# EAGLE design 128x32 (EAGLE 7.4.0)
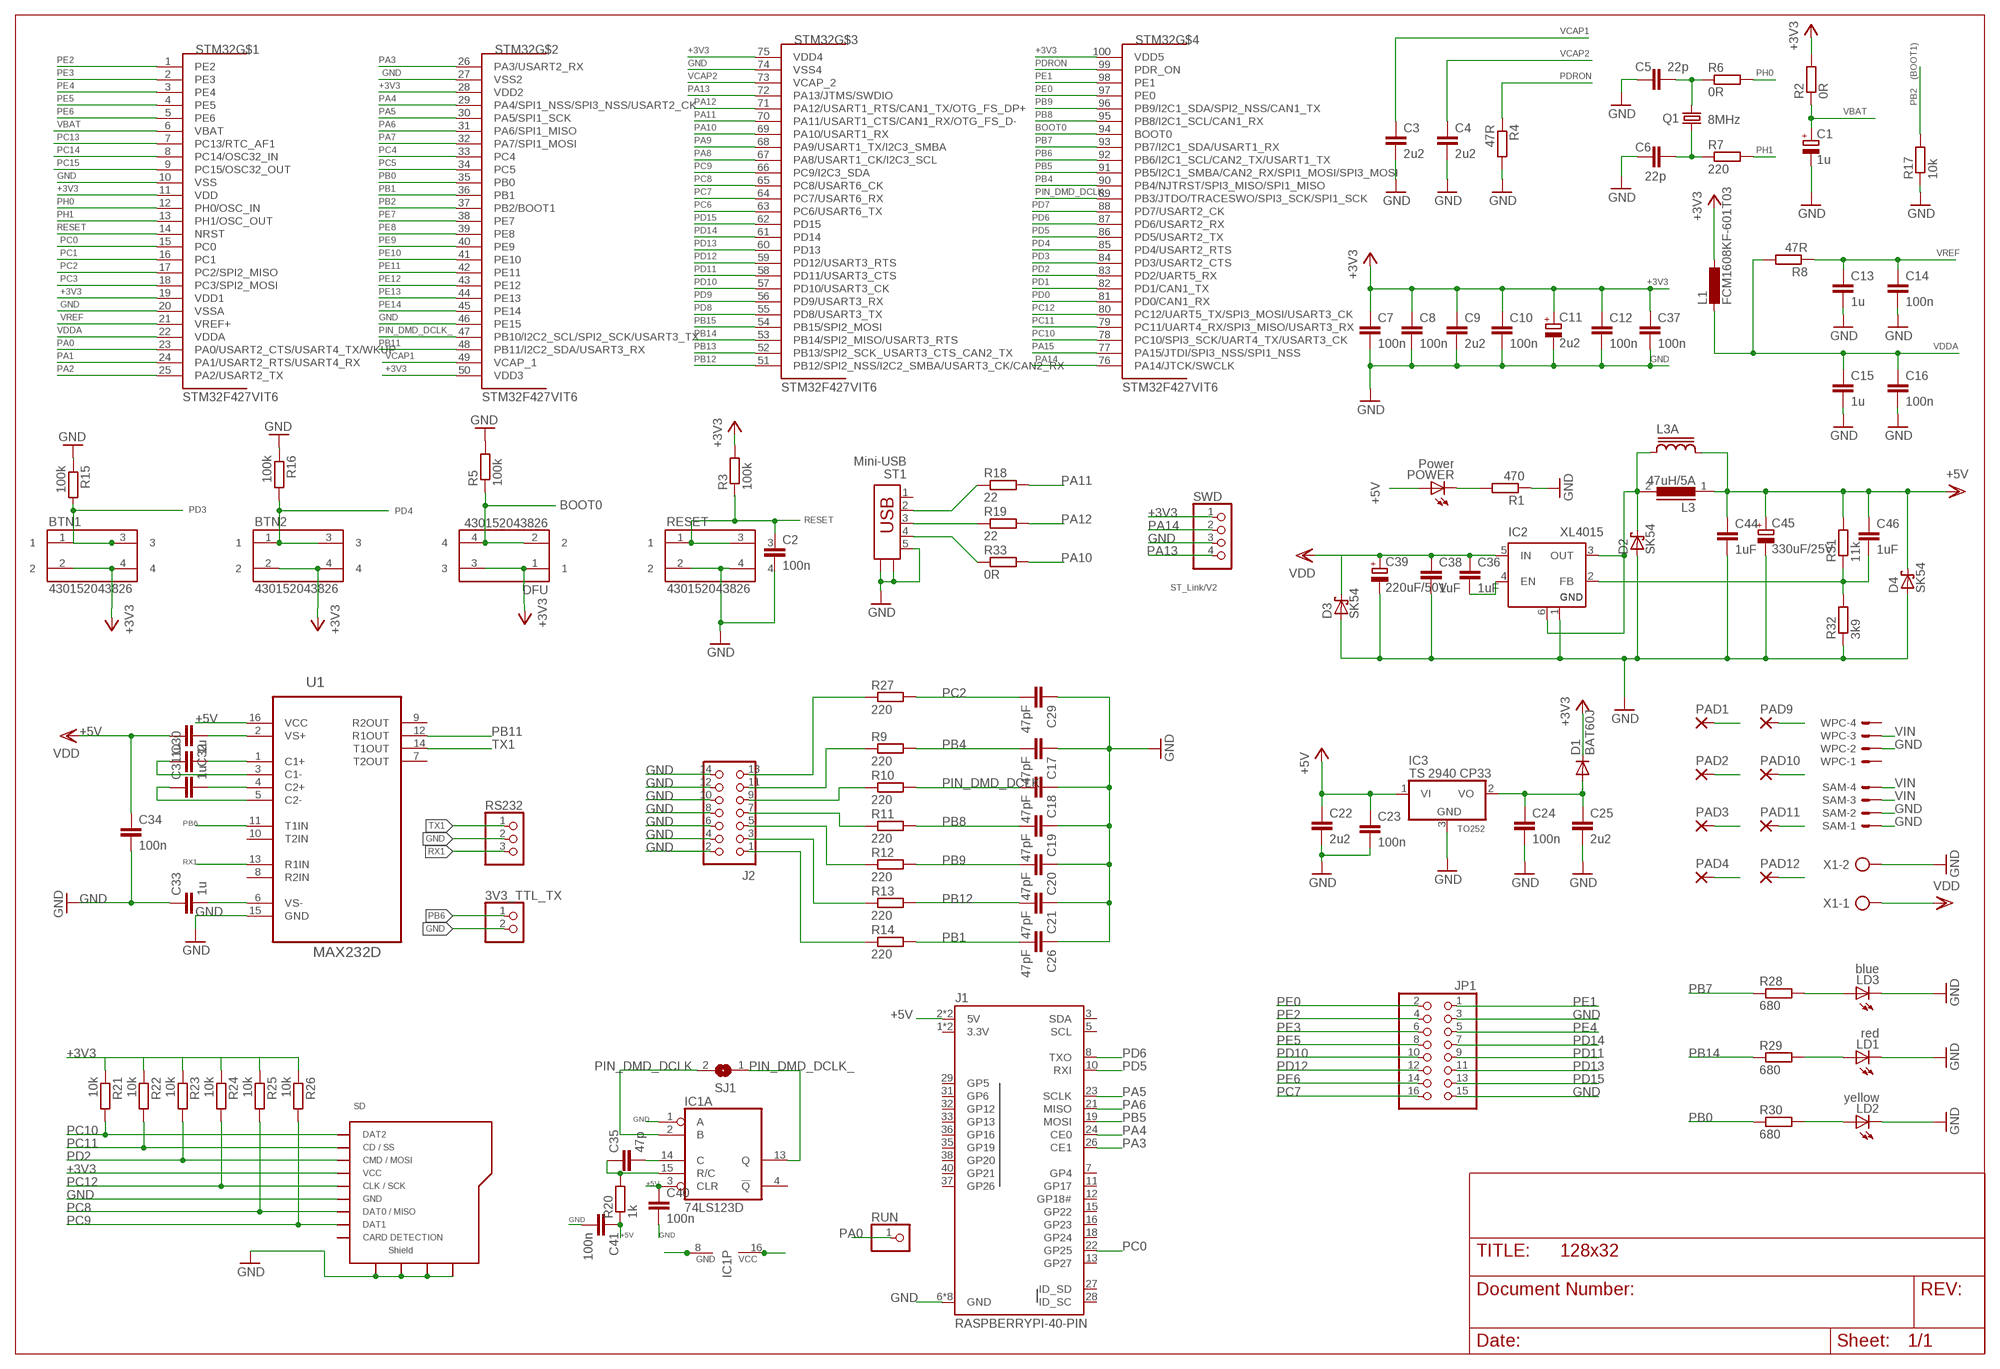
[diagram p0: schematic, sheet 1]

## Parts
3V3_TTL_TX  PINHD-1X2  [1X02]
BTN1  430152043826  [430152043826]
BTN2  430152043826  [430152043826]
C1  1u  CPOL-EUCT3528  [CT3528]
C2  100n  C-EUC0805  [C0805]
C3  2u2  C-EUC0805  [C0805]
C4  2u2  C-EUC0805  [C0805]
C5  22p  C-EUC0805  [C0805]
C6  22p  C-EUC0805  [C0805]
C7  100n  C-EUC0805  [C0805]
C8  100n  C-EUC0805  [C0805]
C9  2u2  C-EUC1206  [C1206]
C10  100n  C-EUC0805  [C0805]
C11  2u2  CPOL-EUCT3528  [CT3528]
C12  100n  C-EUC0805  [C0805]
C13  1u  C-EUC1206  [C1206]
C14  100n  C-EUC0805  [C0805]
C15  1u  C-EUC1206  [C1206]
C16  100n  C-EUC0805  [C0805]
C17  47pF  C-EUC0805  [C0805]
C18  47pF  C-EUC0805  [C0805]
C19  47pF  C-EUC0805  [C0805]
C20  47pF  C-EUC0805  [C0805]
C21  47pF  C-EUC0805  [C0805]
C22  2u2  C-EUC1206  [C1206]
C23  100n  C-EUC0805  [C0805]
C24  100n  C-EUC0805  [C0805]
C25  2u2  C-EUC1206  [C1206]
C26  47pF  C-EUC0805  [C0805]
C29  47pF  C-EUC0805  [C0805]
C30  1u  C-EUC0805  [C0805]
C31  1u  C-EUC0805  [C0805]
C32  1u  C-EUC0805  [C0805]
C33  1u  C-EUC0805  [C0805]
C34  100n  C-EUC0805  [C0805]
C35  47p  C-EUC0805  [C0805]
C36  1uF  C-EUC1206  [C1206]
C37  100n  C-EUC0805  [C0805]
C38  1uF  C-EUC1206  [C1206]
C39  220uF/50V  CPOL-EUG  [PANASONIC_G]
C40  100n  C-EUC0805  [C0805]
C41  100n  C-EUC0805  [C0805]
C44  1uF  C-EUC1206  [C1206]
C45  330uF/25V  CPOL-EUG  [PANASONIC_G]
C46  1uF  C-EUC1206  [C1206]
D1  BAT60J  DIODE-SOD323-W  [SOD323-W]
D2  SK54  SCHOTTKY-DIODESMD  [SMB]
D3  SK54  SCHOTTKY-DIODESMD  [SMB]
D4  SK54  SCHOTTKY-DIODESMD  [SMB]
DFU  430152043826  [430152043826]
IC1  74LS123D  [SO16]
IC2  XL4015  [TO263-5]
IC3  TS 2940 CP33  7808DT  [TO252]
J1  RASPBERRYPI-40-PIN  RASPBERRYPI-40-PIN-GPIO_PTH_NO_SHROUD  [2X20]
J2  CON_HEADER_2X07-PTH-SHROUDED  [PINSHRD_PTH_2X07]
JP1  PINHD-2X8  [2X08]
L1  FCM1608KF-601T03  L-EUL2012C  [L2012C]
L3  47uH/5A  ED16  [ED16]
L3A  SRR1206  [SRR1206]
LD1  red  LEDCHIP-LED0805  [CHIP-LED0805]
LD2  yellow  LEDCHIP-LED0805  [CHIP-LED0805]
LD3  blue  LEDCHIP-LED0805  [CHIP-LED0805]
PAD1  SMD5  [SMD2,54-5,08]
PAD2  SMD5  [SMD2,54-5,08]
PAD3  SMD5  [SMD2,54-5,08]
PAD4  SMD5  [SMD2,54-5,08]
PAD9  SMD5  [SMD2,54-5,08]
PAD10  SMD5  [SMD2,54-5,08]
PAD11  SMD5  [SMD2,54-5,08]
PAD12  SMD5  [SMD2,54-5,08]
POWER  Power  LEDCHIPLED_0805  [CHIPLED_0805]
Q1  8MHz  CRYSTALHC49UP  [HC49UP]
R1  470  R-EU_R0805  [R0805]
R2  0R  R-EU_R0805  [R0805]
R3  100k  R-EU_R0805  [R0805]
R4  47R  R-EU_R0805  [R0805]
R5  100k  R-EU_R0805  [R0805]
R6  0R  R-EU_R0805  [R0805]
R7  220  R-EU_R0805  [R0805]
R8  47R  R-EU_R0805  [R0805]
R9  220  R-EU_R0805  [R0805]
R10  220  R-EU_R0805  [R0805]
R11  220  R-EU_R0805  [R0805]
R12  220  R-EU_R0805  [R0805]
R13  220  R-EU_R0805  [R0805]
R14  220  R-EU_R0805  [R0805]
R15  100k  R-EU_R0805  [R0805]
R16  100k  R-EU_R0805  [R0805]
R17  10k  R-EU_R0805  [R0805]
R18  22  R-EU_R0805  [R0805]
R19  22  R-EU_R0805  [R0805]
R20  1k  R-EU_R0805  [R0805]
R21  10k  R-EU_R0805  [R0805]
R22  10k  R-EU_R0805  [R0805]
R23  10k  R-EU_R0805  [R0805]
R24  10k  R-EU_R0805  [R0805]
R25  10k  R-EU_R0805  [R0805]
R26  10k  R-EU_R0805  [R0805]
R27  220  R-EU_R0805  [R0805]
R28  680  R-EU_R0805  [R0805]
R29  680  R-EU_R0805  [R0805]
R30  680  R-EU_R0805  [R0805]
R31  11k  R-EU_R1206  [R1206]
R32  3k9  R-EU_R1206  [R1206]
R33  0R  R-EU_R0805  [R0805]
RESET  430152043826  [430152043826]
RS232  PINHD-1X3  [1X03]
RUN  PINHD-1X1  [1X01]
SAM  KK-156-4  [KK-156-4]
SD  MICROSD_CARD_POLLIN  [MR**-AP*03**]
SJ1  SJ  [SJ]
ST1  Mini-USB  UBS-MINI  [USBMINI]
STM32  STM32F427VIT6  STM32F407VX  [LQFP100]
SWD  PINHD-1X4  [1X04]
U1  MAX232D  [SOIC127P600X175-16N]
WPC  KK-156-4  [KK-156-4]
X1  AK500/2-H  [AK500/2-H]

## Nets
+3V3: BTN1.2 BTN1.4 BTN2.2 BTN2.4 C7.1 C8.1 C9.1 C10.1 C11.+ C12.1 C37.1 D1.C DFU.1 DFU.3 L1.1 R2.2 R3.2 R21.1 R22.1 R23.1 R24.1 R25.1 R26.1 SD.VCC STM32.11(VDD) STM32.19(VDD1) STM32.28(VDD2) STM32.50(VDD3) STM32.75(VDD4) STM32.100(VDD5) SWD.1
+5V: C22.1 C23.1 C32.2 C34.1 C40.1 C41.1 C44.1 C45.+ C46.1 D4.C IC1.3(A:CLR) IC1.16(P:VCC) IC3.1(VI) J1.2(5V) J1.4(5V) L3.1 L3A.2 PAD1.1(P) PAD2.1(P) PAD9.1(P) PAD10.1(P) POWER.A R20.1 R31.2 U1.16(VCC) ; supply symbol labelled VDD
BOOT0: DFU.2 DFU.4 R5.1 STM32.94(BOOT0)
GND: 3V3_TTL_TX.2 C1.- C2.2 C3.2 C4.2 C5.2 C6.2 C7.2 C8.2 C9.2 C10.2 C11.- C12.2 C13.2 C14.2 C15.2 C16.2 C17.1 C18.1 C19.1 C20.1 C21.1 C22.2 C23.2 C24.2 C25.2 C26.1 C29.1 C33.1 C34.2 C37.2 C38.2 C39.- C40.2 C41.2 C44.2 C45.- D2.A D3.A D4.A IC1.1(A:A) IC1.8(P:GND) IC2.1(GND) IC3.3(GND) J1.6(GND) J1.9(GND) J1.14(GND) J1.20(GND) J1.25(GND) J1.30(GND) J1.34(GND) J1.39(GND) J2.2 J2.4 J2.6 J2.8 J2.10 J2.12 J2.14 JP1.3 JP1.15 LD1.C LD2.C LD3.C PAD3.1(P) PAD4.1(P) PAD11.1(P) PAD12.1(P) R1.1 R4.2 R5.2 R15.1 R16.1 R17.1 R32.1 RESET.2 RESET.4 RS232.2 SAM.1 SAM.2 SD.GND SD.SHD_1(SHD1) SD.SHD_2(SHD2) SD.SHD_3(SHD3) SD.SHD_4(SHD4) ST1.5 ST1.N1 ST1.N2 STM32.10(VSS) STM32.20(VSSA) STM32.27(VSS2) STM32.46(PE15) STM32.74(VSS4) SWD.3 U1.15(GND) WPC.2 X1.2
N$1: C5.1 Q1.2 R6.1
N$2: C6.1 Q1.1 R7.1
N$3: POWER.C R1.2
N$4: J2.13 R27.1
N$5: J2.11 R9.1
N$6: J2.9 R10.1
N$7: J2.7 R11.1
N$8: J2.5 R12.1
N$9: J2.3 R13.1
N$10: C35.1 IC1.15(A:R/C) R20.2
N$11: J2.1 R14.1
N$12: C24.1 C25.1 D1.A IC3.2(VO)
N$13: C30.2 U1.1(C1+)
N$14: C30.1 U1.3(C1-)
N$15: C31.2 U1.4(C2+)
N$16: C31.1 U1.5(C2-)
N$17: C33.2 U1.6(VS-)
N$18: C32.1 U1.2(VS+)
N$19: LD1.A R29.2
N$20: D2.C IC2.3(OUT) IC2.6(TAB) L3.2 L3A.1
N$21: C46.2 IC2.2(FB) R31.1 R32.2
N$22: C35.2 IC1.14(A:C)
N$23: LD3.A R28.2
N$24: C36.2 IC2.4(EN)
N$25: R33.1 ST1.4
N$26: LD2.A R30.2
N$39: R19.1 ST1.3
N$40: R18.1 ST1.2
PA0: RUN.1 STM32.23(PA0/USART2_CTS/USART4_TX/WKUP)
PA1: STM32.24(PA1/USART2_RTS/USART4_RX)
PA2: STM32.25(PA2/USART2_TX)
PA3: J1.26(CE1) STM32.26(PA3/USART2_RX)
PA4: J1.24(CE0) STM32.29(PA4/SPI1_NSS/SPI3_NSS/USART2_CK)
PA5: J1.23(SCLK) STM32.30(PA5/SPI1_SCK)
PA6: J1.21(MISO) STM32.31(PA6/SPI1_MISO)
PA7: STM32.32(PA7/SPI1_MOSI)
PA8: STM32.67(PA8/USART1_CK/I2C3_SCL)
PA9: STM32.68(PA9/USART1_TX/I2C3_SMBA)
PA10: R33.2 STM32.69(PA10/USART1_RX)
PA11: R18.2 STM32.70(PA11/USART1_CTS/CAN1_RX/OTG_FS_D-)
PA12: R19.2 STM32.71(PA12/USART1_RTS/CAN1_TX/OTG_FS_DP+)
PA13: STM32.72(PA13/JTMS/SWDIO) SWD.4
PA14: STM32.76(PA14/JTCK/SWCLK) SWD.2
PA15: STM32.77(PA15/JTDI/SPI3_NSS/SPI1_NSS)
PB0: R30.1 STM32.35(PB0)
PB1: C26.2 R14.2 STM32.36(PB1)
PB2: R17.2 STM32.37(PB2/BOOT1)
PB4: C17.2 R9.2 STM32.90(PB4/NJTRST/SPI3_MISO/SPI1_MISO)
PB5: J1.19(MOSI) STM32.91(PB5/I2C1_SMBA/CAN2_RX/SPI1_MOSI/SPI3_MOSI)
PB6: 3V3_TTL_TX.1 STM32.92(PB6/I2C1_SCL/CAN2_TX/USART1_TX) U1.11(T1IN)
PB7: R28.1 STM32.93(PB7/I2C1_SDA/USART1_RX)
PB8: C19.2 R11.2 STM32.95(PB8/I2C1_SCL/CAN1_RX)
PB9: C20.2 R12.2 STM32.96(PB9/I2C1_SDA/SPI2_NSS/CAN1_TX)
PB11: STM32.48(PB11/I2C2_SDA/USART3_RX) U1.12(R1OUT)
PB12: C21.2 R13.2 STM32.51(PB12/SPI2_NSS/I2C2_SMBA/USART3_CK/CAN2_RX)
PB13: STM32.52(PB13/SPI2_SCK_USART3_CTS_CAN2_TX)
PB14: R29.1 STM32.53(PB14/SPI2_MISO/USART3_RTS)
PB15: STM32.54(PB15/SPI2_MOSI)
PC0: J1.22(GP25) STM32.15(PC0)
PC1: STM32.16(PC1)
PC2: C29.2 R27.2 STM32.17(PC2/SPI2_MISO)
PC3: STM32.18(PC3/SPI2_MOSI)
PC4: STM32.33(PC4)
PC5: STM32.34(PC5)
PC6: STM32.63(PC6/USART6_TX)
PC7: JP1.16 STM32.64(PC7/USART6_RX)
PC8: R25.2 SD.DAT0(DAT0/MISO) STM32.65(PC8/USART6_CK)
PC9: R26.2 SD.DAT1 STM32.66(PC9/I2C3_SDA)
PC10: R21.2 SD.DAT2 STM32.78(PC10/SPI3_SCK/UART4_TX/USART3_CK)
PC11: R22.2 SD.DAT3/CS(CD/SS) STM32.79(PC11/UART4_RX/SPI3_MISO/USART3_RX)
PC12: R24.2 SD.CLK(CLK/SCK) STM32.80(PC12/UART5_TX/SPI3_MOSI/USART3_CK)
PC13: STM32.7(PC13/RTC_AF1)
PC14: STM32.8(PC14/OSC32_IN)
PC15: STM32.9(PC15/OSC32_OUT)
PD0: STM32.81(PD0/CAN1_RX)
PD1: STM32.82(PD1/CAN1_TX)
PD2: R23.2 SD.CMD(CMD/MOSI) STM32.83(PD2/UART5_RX)
PD3: BTN1.1 BTN1.3 R15.2 STM32.84(PD3/USART2_CTS)
PD4: BTN2.1 BTN2.3 R16.2 STM32.85(PD4/USART2_RTS)
PD5: J1.10(RXI) STM32.86(PD5/USART2_TX)
PD6: J1.8(TXO) STM32.87(PD6/USART2_RX)
PD7: STM32.88(PD7/USART2_CK)
PD8: STM32.55(PD8/USART3_TX)
PD9: STM32.56(PD9/USART3_RX)
PD10: JP1.10 STM32.57(PD10/USART3_CK)
PD11: JP1.9 STM32.58(PD11/USART3_CTS)
PD12: JP1.12 STM32.59(PD12/USART3_RTS)
PD13: JP1.11 STM32.60(PD13)
PD14: JP1.7 STM32.61(PD14)
PD15: JP1.13 STM32.62(PD15)
PDRON: R4.1 STM32.99(PDR_ON)
PE0: JP1.2 STM32.97(PE0)
PE1: JP1.1 STM32.98(PE1)
PE2: JP1.4 STM32.1(PE2)
PE3: JP1.6 STM32.2(PE3)
PE4: JP1.5 STM32.3(PE4)
PE5: JP1.8 STM32.4(PE5)
PE6: JP1.14 STM32.5(PE6)
PE7: STM32.38(PE7)
PE8: STM32.39(PE8)
PE9: STM32.40(PE9)
PE10: STM32.41(PE10)
PE11: STM32.42(PE11)
PE12: STM32.43(PE12)
PE13: STM32.44(PE13)
PE14: STM32.45(PE14)
PH0: R6.2 STM32.12(PH0/OSC_IN)
PH1: R7.2 STM32.13(PH1/OSC_OUT)
PIN_DMD_DCLK: C18.2 IC1.2(A:B) R10.2 SJ1.2
PIN_DMD_DCLK_: IC1.13(A:Q) SJ1.1 STM32.47(PB10/I2C2_SCL/SPI2_SCK/USART3_TX) STM32.89(PB3/JTDO/TRACESWO/SPI3_SCK/SPI1_SCK)
RESET: C2.1 R3.1 RESET.1 RESET.3 STM32.14(NRST)
RX1: RS232.3 U1.13(R1IN)
TX1: RS232.1 U1.14(T1OUT)
VBAT: C1.+ R2.1 STM32.6(VBAT)
VCAP1: C3.1 STM32.49(VCAP_1)
VCAP2: C4.1 STM32.73(VCAP_2)
VDDA: C15.1 C16.1 L1.2 R8.2 STM32.22(VDDA)
VIN: C36.1 C38.1 C39.+ D3.C IC2.5(IN) SAM.3 SAM.4 WPC.3 X1.1 ; supply symbol labelled VDD
VREF: C13.1 C14.1 R8.1 STM32.21(VREF+)
Unconnected: IC1.4(A:!Q) IC1.5(B:Q) IC1.6(B:C) IC1.7(B:R/C) IC1.9(B:A) IC1.10(B:B) IC1.11(B:CLR) IC1.12(B:!Q) J1.3(SDA) J1.5(SCL) J1.7(GP4) J1.11(GP17) J1.12(GP18#) J1.13(GP27) J1.15(GP22) J1.16(GP23) J1.18(GP24) J1.27(ID_SD) J1.28(ID_SC) J1.29(GP5) J1.31(GP6) J1.32(GP12) J1.33(GP13) J1.35(GP19) J1.36(GP16) J1.37(GP26) J1.38(GP20) J1.40(GP21) SD.CARD_DETECTION(CARD_D) ST1.1 U1.7(T2OUT) U1.8(R2IN) U1.9(R2OUT) U1.10(T2IN) WPC.1 WPC.4

## Notes on the sheet
- (BOOT1)
- ST_Link/V2
- TO252

## Power pins joined to a net without a drawn wire
3.3V: J1.1(3.3V) J1.17(3.3V)

## Library data of the parts
3V3_TTL_TX = pinhead:PINHD-1X2: PIN HEADER
BTN1 BTN2 DFU RESET = Switches_rev16a:430152043826: WS-TSS-6x6 mm SMD Tact Switch,4 pins
C1 C11 = rcl:CPOL-EU: POLARIZED CAPACITOR, European symbol
C2 C5-C8 C10 C12 C16 C23 C24 C37 = rcl:C-EU: CAPACITOR, European symbol
C3 C4 C9 C13-C15 C17-C22 C25 C26 C29-C36 C38 C40 C41 C44 C46 = resistor:C-EU: CAPACITOR, European symbol
C39 C45 = resistor:CPOL-EU: POLARIZED CAPACITOR, European symbol
D1 = diode:DIODE-: DIODE
D2-D4 = diode:SCHOTTKY-DIODE: Schottky Diode
IC1 = 74xx-eu:74*123: Retriggerable monostable MULTIVIBRATOR
IC2 = linear4:XL4015
IC3 = linear:78*: Positive VOLTAGE REGULATOR Source: http://cache.national.com/ds/LM/LM78L05.pdf http://www.fairchildsemi.com/ds/LM/LM7805.pdf
J1 = SparkFun-Connectors:RASPBERRYPI-40-PIN-GPIO: Raspberry Pi GPIO Header 2x20 pin connector, as found on B, B+, A+ models. Both shrouded PTH and SMT versions available. SparkFun Products: GPIO Shrouded Header <https://www.sparkfun.com/products/13054>- PTH SparkFun Pi Wedge (Preassembled) <https://www.sparkfun.com/products/13717>
J2 = dp_devices.v6:CON_HEADER_2X07: 2x07 pin header
JP1 = pinhead:PINHD-2X8: PIN HEADER
L1 = rcl:L-EU: INDUCTOR, European symbol
L3 = inductors:ED16: INDUCTOR
L3A = inductor-bourns:SRR1206: POWER INDUCTOR
LD1-LD3 = adafruit:LED: LED
PAD1-PAD4 PAD9-PAD12 = wirepad:SMD5: SMD PAD
POWER = led:LED: LED
Q1 = crystal:CRYSTAL: CRYSTAL; OC_FARNELL: unknown; OC_NEWARK: unknown
R1 R2 R4 R6-R8 R17 R20 = rcl:R-EU_: RESISTOR, European symbol
R3 R5 R9-R16 R18 R19 R21-R33 = resistor:R-EU_: RESISTOR, European symbol
RS232 = pinhead:PINHD-1X3: PIN HEADER
RUN = pinhead:PINHD-1X1: PIN HEADER
SAM WPC = con-molex:KK-156-4: KK 156 HEADER Source: http://www.molex.com/pdm_docs/sd/026604100_sd.pdf; OC_FARNELL: unknown; OC_NEWARK: unknown
SD = 000_eigene_Bauteile:MICROSD_CARD_POLLIN
SJ1 = jumper:SJ: SMD solder JUMPER
ST1 = con-amp:UBS-MINI
STM32 = STM32F407Vx_LQFP100:STM32F407VX: STmicroelectronics Cortex M4 Series Typ: STM32F407Vx LQFP100 Copyright 2012 by Ersan Günes, Quantitec, info@quantitec.de
SWD = pinhead:PINHD-1X4: PIN HEADER
U1 = MAX232D:MAX232D: DUAL EIA-232 DRIVERS/RECEIVERS
X1 = con-ptr500:AK500/2-H: CONNECTOR Aug. 2004 / PTR Meßtechnik: Die Bezeichnung der Serie AK505 wurde geändert. Es handelt sich hierbei um AK500 in horizontaler Ausführung.; OC_FARNELL: unknown; OC_NEWARK: unknown

## Board
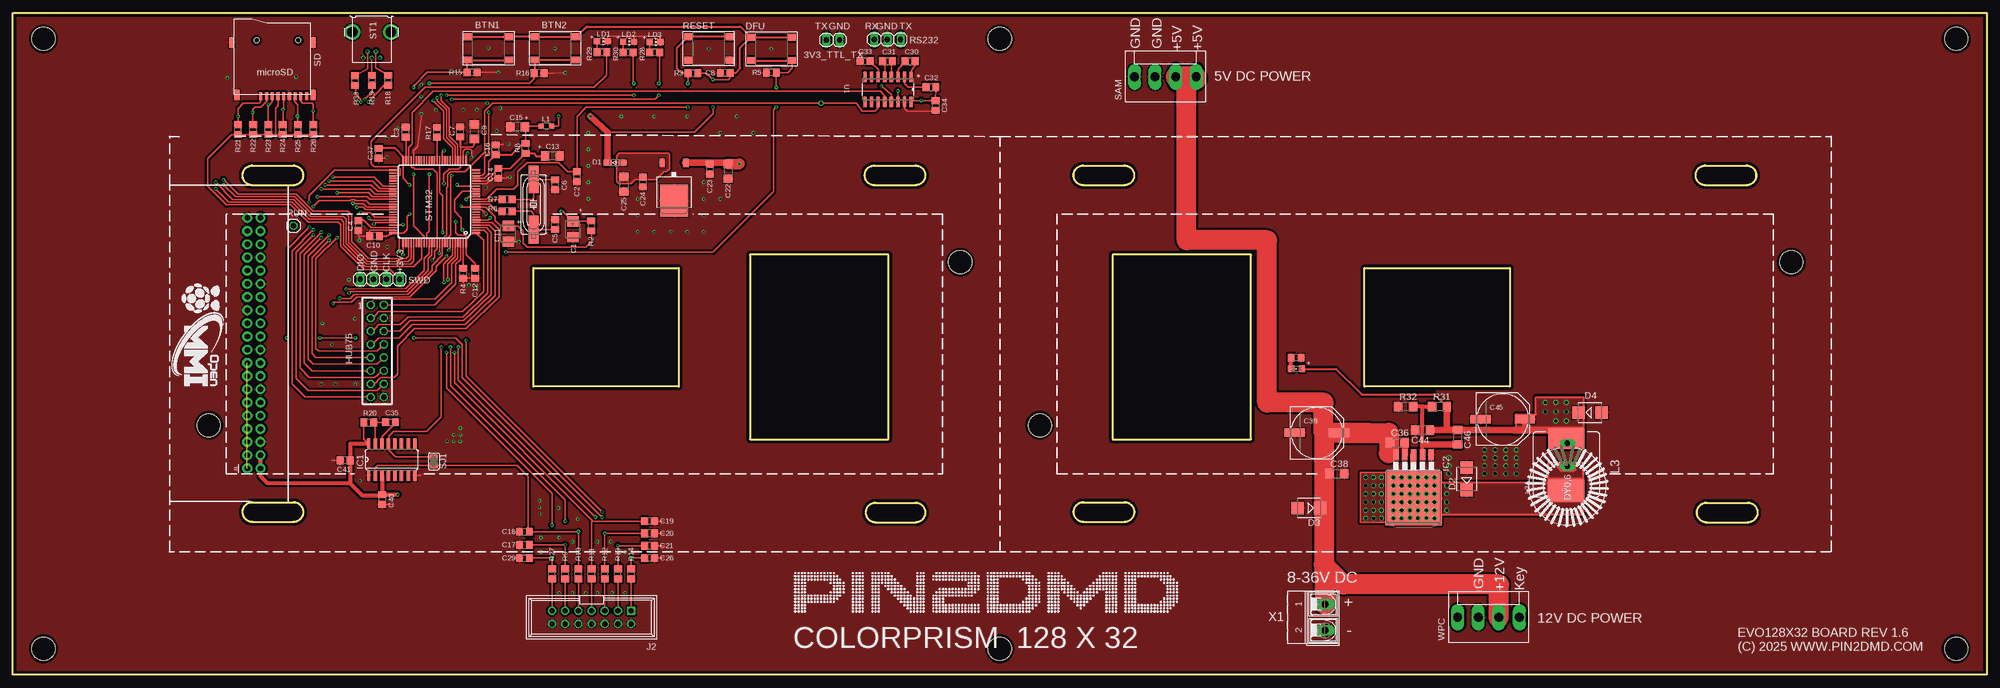
[diagram p1: board, top side]
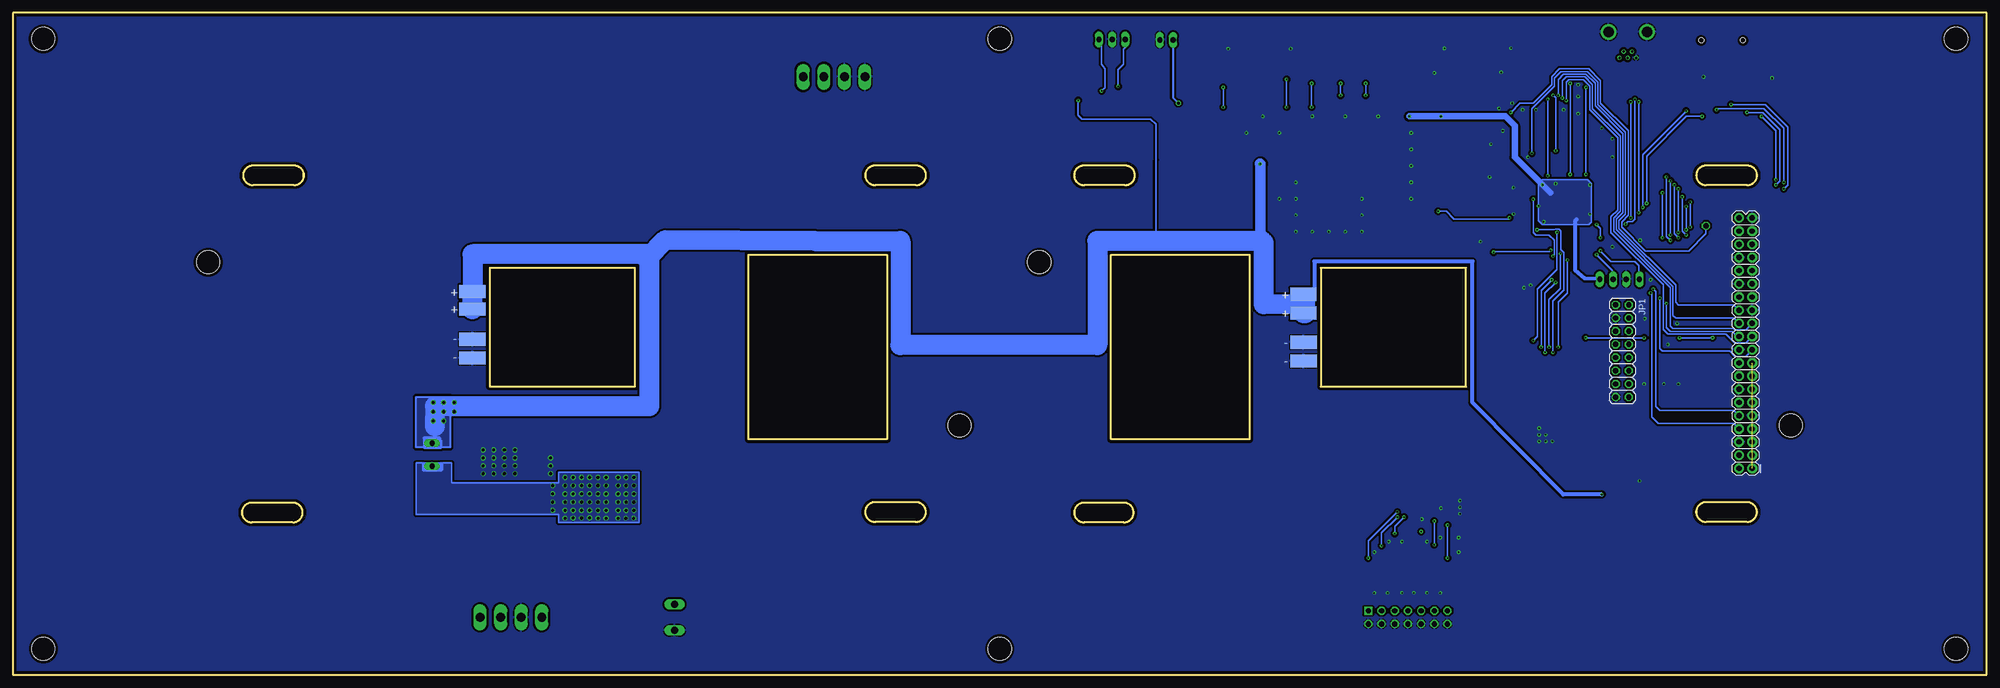
[diagram p2: board, bottom side, seen from below]

Size 380.03 x 127.5 mm. Coordinates in mm from the lower left corner, seen from the top.
Outline: 0,127.5 380.03,127.5 380.03,0 0,0 0,127.5
Outline: 168.57,80.9 141.9,80.9 141.9,45.34 168.57,45.34 168.57,80.9
Outline: 100.24,78.36 128.18,78.36 128.18,55.5 100.24,55.5 100.24,78.36
Outline: 260.26,78.36 288.2,78.36 288.2,55.5 260.26,55.5 260.26,78.36
Outline: 238.42,80.9 211.75,80.9 211.75,45.34 238.42,45.34 238.42,80.9
Outline: 46.1,98.11 53.98,98.11 arc-180 53.98,94.3 46.1,94.3 arc-180 46.1,98.11
Outline: 46.12,33.25 54,33.25 arc-180 54,29.44 46.12,29.44 arc-180 46.12,33.25
Outline: 165.9,98.11 173.77,98.11 arc-180 173.77,94.3 165.9,94.3 arc-180 165.9,98.11
Outline: 166.14,33.15 173.76,33.15 arc-180 173.76,29.34 166.14,29.34 arc-180 166.14,33.15
Outline: 206.12,98.11 214,98.11 arc-180 214,94.3 206.12,94.3 arc-180 206.12,98.11
Outline: 325.92,98.11 333.79,98.11 arc-180 333.79,94.3 325.92,94.3 arc-180 325.92,98.11
Outline: 206.14,33.25 214.02,33.25 arc-180 214.02,29.44 206.14,29.44 arc-180 206.14,33.25
Outline: 326.16,33.15 334.03,33.15 arc-180 334.03,29.34 326.16,29.34 arc-180 326.16,33.15
Copper layers (1*16): Top 0.035mm / dielectric 1.6mm / Bottom 0.035mm
Design rules "Elecrow_2-layer_PCB_eagle_rule": minimum track width 6mil, minimum drill 12mil, track to track 6mil, track to pad 6mil, pad to pad 6mil, via to via 8mil, smd to smd 0mil, copper to edge 20mil, drill to drill 10mil, minimum pad ring 6mil, minimum via ring 6mil, stop-mask expansion 0mil, vias tented up to drill 100mil, thermal gap 10mil
Holes 4.5 mm at 5.86,122.52 5.86,5.01 190.03,5.01 374.18,5.01 374.19,122.52 190.02,122.52 37.72,48.06 182.41,79.49 197.74,48.06 342.43,79.49

### Footprints (pad centres in the part's own frame; a part is rotated, then mirrored left to right if it is on the bottom)
1X02 = drill 1.016 long: 1 -1.27,0; 2 1.27,0
430152043826 = smd 1.55 x 1.3: 1 -3.975,2.25; 2 -3.975,-2.25; 3 3.975,2.25; 4 3.975,-2.25
CT3528 = smd 2 x 2.2: + -1.5,0; - 1.5,0
C0805 = smd 1.3 x 1.5: 1 -0.95,0; 2 0.95,0
C1206 = smd 1.6 x 1.8: 1 -1.4,0; 2 1.4,0
PANASONIC_G = smd 3.9 x 1.6: + 4.25,0; - -4.25,0
SOD323-W = smd 1.5 x 1.2: A 1.45,0; C -1.45,0
SMB = smd 2.4 x 2.4: A 2.2,0; C -2.2,0
SO16 = smd 0.66 x 2.032: 1 -4.445,-3.073; 2 -3.175,-3.073; 3 -1.905,-3.073; 4 -0.635,-3.073; 5 0.635,-3.073; 6 1.905,-3.073; 7 3.175,-3.073; 8 4.445,-3.073; 9 4.445,3.073; 10 3.175,3.073; 11 1.905,3.073; 12 0.635,3.073; 13 -0.635,3.073; 14 -1.905,3.073; 15 -3.175,3.073; 16 -4.445,3.073
TO263-5 = smd 1.067 x 2.159: 1 -3.404,-5.791; 2 -1.702,-5.791; 3 0,-5.791; 4 1.702,-5.791; 5 3.404,-5.791 | smd 10.8 x 10.41: 6 0,2.54
TO252 = smd 1 x 1.6: 1 -2.28,-4.8; 2 2.28,-4.8 | smd 5.4 x 6.2: 3 0,2.5
2X20 = drill 1.016 pad 1.88: 1 0,0; 2 0,2.54; 3 2.54,0; 4 2.54,2.54; 5 5.08,0; 6 5.08,2.54; 7 7.62,0; 8 7.62,2.54; 9 10.16,0; 10 10.16,2.54; 11 12.7,0; 12 12.7,2.54; 13 15.24,0; 14 15.24,2.54; 15 17.78,0; 16 17.78,2.54; 17 20.32,0; 18 20.32,2.54; 19 22.86,0; 20 22.86,2.54; 21 25.4,0; 22 25.4,2.54; 23 27.94,0; 24 27.94,2.54; 25 30.48,0; 26 30.48,2.54; 27 33.02,0; 28 33.02,2.54; 29 35.56,0; 30 35.56,2.54; 31 38.1,0; 32 38.1,2.54; 33 40.64,0; 34 40.64,2.54; 35 43.18,0; 36 43.18,2.54; 37 45.72,0; 38 45.72,2.54; 39 48.26,0; 40 48.26,2.54
PINSHRD_PTH_2X07 = drill 1.016 square: 1 -7.62,-1.27 | drill 1.016 octagon: 2 -7.62,1.27; 3 -5.08,-1.27; 4 -5.08,1.27; 5 -2.54,-1.27; 6 -2.54,1.27; 7 0,-1.27; 8 0,1.27; 9 2.54,-1.27; 10 2.54,1.27; 11 5.08,-1.27; 12 5.08,1.27; 13 7.62,-1.27; 14 7.62,1.27
2X08 = drill 1.016 octagon: 1 -8.89,-1.27; 2 -8.89,1.27; 3 -6.35,-1.27; 4 -6.35,1.27; 5 -3.81,-1.27; 6 -3.81,1.27; 7 -1.27,-1.27; 8 -1.27,1.27; 9 1.27,-1.27; 10 1.27,1.27; 11 3.81,-1.27; 12 3.81,1.27; 13 6.35,-1.27; 14 6.35,1.27; 15 8.89,-1.27; 16 8.89,1.27
L2012C = smd 1 x 1: 1 -1,0; 2 1,0
ED16 = drill 1.016 long: 1 -8.255,0; 2 -3.81,0
SRR1206 = smd 4 x 7: 1 -5,0; 2 5,0
CHIP-LED0805 = smd 1.2 x 1.2: A 0,-1.05; C 0,1.05
SMD2,54-5,08 = smd 2.54 x 5.08: 1 0,0
CHIPLED_0805 = smd 1.2 x 1.2: A 0,-1.05; C 0,1.05
HC49UP = smd 5.334 x 1.93: 1 -4.826,0; 2 4.826,0
R0805 = smd 1.3 x 1.5: 1 -0.95,0; 2 0.95,0
R1206 = smd 1.6 x 1.803: 1 -1.422,0; 2 1.422,0
1X03 = drill 1.016 long: 1 -2.54,0; 2 0,0; 3 2.54,0
1X01 = drill 1.016 octagon: 1 0,0
KK-156-4 = drill 1.7 pad 2.184 long: 1 -5.94,0; 2 -1.98,0; 3 1.98,0; 4 5.94,0
MR**-AP*03** = smd 0.6 x 1.5: CARD_DETECTION -6.55,0.3; CLK -2.15,0.3; CMD 0.05,0.3; DAT0 -4.35,0.3; DAT1 -5.45,0.3; DAT2 2.25,0.3; DAT3/CS 1.15,0.3; GND -3.25,0.3; VCC -1.05,0.3 | smd 1 x 2: SHD_1 -7.85,0; SHD_2 6.85,0; SHD_3 -7.85,-10.1; SHD_4 7.85,-10.1 | hole 1: -4.95,-10.5; 3.05,-10.5
SJ = smd 1.168 x 1.6: 1 -0.762,0; 2 0.762,0
USBMINI = drill 0.5: 1 -1.6,3; 2 -0.8,1.8; 3 0,3; 4 0.8,1.8; 5 1.6,3 | drill 2: N1 -3.7,-2; N2 3.7,-2
LQFP100 = smd 1.5 x 0.4: 1 -8,6.075; 25 -8,-6.075; 51 8,-6.075; 75 8,6.075 | smd 1.5 x 0.25: 2 -8,5.5; 3 -8,5; 4 -8,4.5; 5 -8,4; 6 -8,3.5; 7 -8,3; 8 -8,2.5; 9 -8,2; 10 -8,1.5; 11 -8,1; 12 -8,0.5; 13 -8,0; 14 -8,-0.5; 15 -8,-1; 16 -8,-1.5; 17 -8,-2; 18 -8,-2.5; 19 -8,-3; 20 -8,-3.5; 21 -8,-4; 22 -8,-4.5; 23 -8,-5; 24 -8,-5.5; 52 8,-5.5; 53 8,-5; 54 8,-4.5; 55 8,-4; 56 8,-3.5; 57 8,-3; 58 8,-2.5; 59 8,-2; 60 8,-1.5; 61 8,-1; 62 8,-0.5; 63 8,0; 64 8,0.5; 65 8,1; 66 8,1.5; 67 8,2; 68 8,2.5; 69 8,3; 70 8,3.5; 71 8,4; 72 8,4.5; 73 8,5; 74 8,5.5 | smd 0.4 x 1.5: 26 -6.075,-8; 50 6.075,-8; 76 6.075,8; 100 -6.075,8 | smd 0.25 x 1.5: 27 -5.5,-8; 28 -5,-8; 29 -4.5,-8; 30 -4,-8; 31 -3.5,-8; 32 -3,-8; 33 -2.5,-8; 34 -2,-8; 35 -1.5,-8; 36 -1,-8; 37 -0.5,-8; 38 0,-8; 39 0.5,-8; 40 1,-8; 41 1.5,-8; 42 2,-8; 43 2.5,-8; 44 3,-8; 45 3.5,-8; 46 4,-8; 47 4.5,-8; 48 5,-8; 49 5.5,-8; 77 5.5,8; 78 5,8; 79 4.5,8; 80 4,8; 81 3.5,8; 82 3,8; 83 2.5,8; 84 2,8; 85 1.5,8; 86 1,8; 87 0.5,8; 88 0,8; 89 -0.5,8; 90 -1,8; 91 -1.5,8; 92 -2,8; 93 -2.5,8; 94 -3,8; 95 -3.5,8; 96 -4,8; 97 -4.5,8; 98 -5,8; 99 -5.5,8
1X04 = drill 1.016 long: 1 -3.81,0; 2 -1.27,0; 3 1.27,0; 4 3.81,0
SOIC127P600X175-16N = smd 2.057 x 0.61: 1 -4.801,8.89; 2 -4.801,7.62; 3 -4.801,6.35; 4 -4.801,5.08; 5 -4.801,3.81; 6 -4.801,2.54; 7 -4.801,1.27; 8 -4.801,0; 9 0,0; 10 0,1.27; 11 0,2.54; 12 0,3.81; 13 0,5.08; 14 0,6.35; 15 0,7.62; 16 0,8.89
AK500/2-H = drill 1.321 long: 1 -2.515,0; 2 2.515,0

### Placement (x,y rotation side)
3V3_TTL_TX  157.9,122.31 0 top
BTN1  91.56,120.69 180 top
BTN2  104.39,120.69 180 top
C1  107.83,85.82 270 top
C2  108.59,95.98 270 top
C3  75.63,104.54 90 top
C4  66.51,86.54 270 top
C5  104.38,86.74 90 top
C6  104.4,94.42 270 top
C7  86.13,104.58 90 top
C8  137.15,115.93 180 top
C9  88.87,104.64 90 top
C10  69.62,84.5 180 top
C11  95.41,84.96 270 top
C12  88.99,77.35 270 top
C13  103.85,99.98 0 top
C14  93.48,96.6 270 top
C15  97.2,105.55 180 top
C16  92.93,101.15 90 top
C17  98.46,25.02 0 top
C18  98.46,27.56 0 top
C19  122.59,29.6 180 top
C20  122.59,27.23 180 top
C21  122.59,24.86 180 top
C22  137.69,97 270 top
C23  134.18,97.42 270 top
C24  121.29,94.94 270 top
C25  117.62,94.49 270 top
C26  122.59,22.48 180 top
C29  98.46,22.48 0 top
C30  172.73,118.23 0 top
C31  168.38,118.23 0 top
C32  176.76,113.22 0 top
C33  164.09,118.25 0 top
C34  177.62,109.67 270 top
C35  72.7,48.65 0 top
C36  266.61,44.72 0 top
C37  70.39,100.48 270 top
C38  254.94,38.73 0 top
C39  251.07,46.61 0 top
C40  71.08,33.76 270 top
C41  63.96,41.31 180 top
C44  271.43,47.12 180 top
C45  286.88,49.24 0 top
C46  278.16,45.77 270 top
D1  115.94,98.65 0 top
D2  279.94,37.72 90 top
D3  249.55,32.12 180 top
D4  303.7,50.51 0 top
DFU  146.06,120.58 0 top
IC1  72.93,41.46 0 top
IC2  269.71,36.55 180 top
IC3  127.29,93.83 180 top
J1  45.12,39.76 90 bottom
J2  111.42,11.05 180 top
JP1  70.13,62.38 270 bottom
L1  102.71,105.67 180 top
L3  299.33,36.37 270 top
L3A  299.12,40.52 90 top
LD1  113.49,122.03 270 top
LD2  118.55,121.97 270 top
LD3  123.62,121.9 270 top
PAD1  131.54,69.68 270 bottom
PAD2  131.54,73.32 270 bottom
PAD3  131.52,60.42 270 bottom
PAD4  131.52,64.06 270 bottom
PAD9  291.54,70.44 270 bottom
PAD10  291.54,73.82 270 bottom
PAD11  291.54,61.02 270 bottom
PAD12  291.56,64.63 270 bottom
POWER  247.17,58.95 90 top
Q1  100.24,90.6 270 top
R1  247.1,61.08 180 top
R2  111.35,86.49 270 top
R3  130.93,115.9 0 top
R4  86.68,77.35 270 top
R5  146.03,116.01 180 top
R6  95.16,89.29 180 top
R7  95.16,91.57 180 top
R8  98.69,101.41 90 top
R9  106.34,19.44 90 top
R10  108.88,19.44 90 top
R11  111.42,19.44 90 top
R12  113.96,19.44 90 top
R13  116.5,19.44 90 top
R14  119.04,19.44 90 top
R15  88.4,116.05 180 top
R16  101.31,115.89 180 top
R17  81.64,104.52 270 top
R18  72.22,114.52 270 top
R19  69.12,114.52 270 top
R20  68.51,48.61 0 top
R21  43.32,105.03 90 top
R22  46.25,105.03 90 top
R23  49.19,105.03 90 top
R24  51.95,105.03 90 top
R25  54.87,105.03 90 top
R26  57.86,105.03 90 top
R27  103.8,19.44 90 top
R28  123.55,119.9 180 top
R29  113.41,119.92 180 top
R30  118.44,119.9 180 top
R31  274.69,51.65 0 top
R32  268.17,51.65 0 top
R33  65.86,114.48 270 top
RESET  133.97,120.67 0 top
RS232  168.38,122.41 180 top
RUN  54.01,86.49 0 top
SAM  221.91,115.19 0 top
SD  49.97,111.74 180 top
SJ1  81.01,41.11 270 top
ST1  69.08,121.85 180 top
STM32  81.17,91.14 180 top
SWD  70.66,76.21 180 top
U1  164.06,110.36 270 top
WPC  284.14,11.05 0 top
X1  252.64,11.05 270 top

### Tracks (layer width: path | path; a pad name or v marks a point on that pad's centre or on a via)
3.3V  (1 unrouted)
+3V3  (via drill 0.3)
  Top 0.254: C8.1 | 75.1,99.85 75.17,99.81 STM32.50 75.09,95.72 v76.37,94.37 | C9.1 88.81,103.18 88.81,101.99 88.51,101.68 86.17,101.68 STM32.28 86.17,97.82 85.76,97.41 83.94,97.41 82.97,96.44 v82.97,94.62 | C12.1 88.99,79.2 87.24,80.98 STM32.100 87.24,84.51 87.03,84.71 85.76,84.71 85.26,85.22 v85.26,87.25 | R2.2 111.42,85.47 111.42,83.44 110.4,82.43 98.97,82.43 98.21,83.19 98.21,85.48 97.23,86.46 C11.+ 95.37,86.49 93.89,86.49 92.88,87.51 92.88,88.27 91.01,90.14 STM32.11 86.44,90.14 v86.27,90.3 | STM32.19 85.74,94.14 v85.51,94.37 | STM32.75 75.19,85.06 75.86,85.73 75.86,88.27 v76.37,88.78 | 105.14,107.5 v105.07,107.57 | 114.49,104.5 131.2,104.5 134.79,108.08 v134.79,109.35 | 62.65,87.25 56.81,87.25 53.51,90.56 41.06,90.56
  Top 0.305: 86.17,103.59 C7.1 | R3.2 133.57,115.9 v134.79,114.69 137.83,114.69 138.09,114.94 C8.1 | 62.65,87.25 63.13,86.77 63.13,82.59 67.64,78.09 72.59,78.09 SWD.1 | v105.07,107.57 105.07,105.67 L1.1 | 41.06,90.56 37.5,94.11 37.5,99.45 42.08,104.02 43.25,104.02 R21.1 R22.1 R23.1 50.71,104.08 | 50.71,104.08 R24.1 R25.1 R26.1 | SD.VCC 51.02,109.66 50.58,109.15 50.58,104.29 50.71,104.08
  Top 0.406: C10.1 71.9,84.5 STM32.75 | 75.1,99.85 73.69,101.33 73.59,101.43 C37.1 | 86.17,101.68 86.17,103.59 | DFU.1 140.06,120.8 140.06,116.87 139.11,115.93 C8.1 | DFU.1 DFU.3 | BTN1.4 BTN1.2 BTN2.4 BTN2.2 110.52,124.85 140.07,124.85 DFU.1
  Top 1.27: D1.C 114.49,104.5 v111.16,107.57
  Bottom 0.254: 85.26,86.75 85.51,86.75 86.27,87.51 v86.27,90.3 86.27,94.62 85.51,95.38 76.87,95.38 76.11,94.62 76.11,87.25 76.62,86.75 85.26,86.75 | v85.26,87.25 85.26,86.75 | v134.79,109.35 v134.79,114.69
  Bottom 0.813: SWD.1 77.38,76.33 79.16,77.86 79.16,87.51 78.91,87.76
  Bottom 1.27: v111.16,107.57 v105.07,107.57 92.62,107.57 90.84,105.8 90.84,99.7 83.99,92.84
  pour Bottom: 76.11,87.25 76.62,86.75 85.51,86.75 86.27,87.51 86.27,94.62 85.51,95.38 76.87,95.38 76.11,94.62
+5V  (via drill 0.3, 0.6)
  Top 0.152: 64.94,41.36 C41.1 | R20.1 | C44.1 272.82,47.21 C44.1
  Top 0.254: IC1.16 67.56,45.45 R20.1
  Top 0.305: U1.16 172.95,110.62 v174.92,110.62 C34.1 177.69,110.69 C32.2 | 68.49,44.48 IC1.16 | C23.1 134.11,98.56 134.11,98.68
  Top 0.406: 74.06,34.71 v74.08,34.72 | POWER.A 254.78,58.95 259.75,53.98 273.74,53.98 276.07,51.65 | 288.96,46.87 289.47,46.87 289.47,50.17 293.28,50.17 293.28,53.47 302.43,53.47 302.43,43.82 295.82,43.82 295.82,46.61 288.96,46.61 288.96,46.87
  Top 0.813: 276.07,51.65 R31.2 | C44.1 272.82,46.96 | C40.1 71.08,38.39 IC1.3 | 68.49,44.48 64.94,44.48 64.94,41.36 64.94,36.85 | 64.94,36.85 67.23,34.56 70.92,34.56 C40.1 | 71.96,34.69 C40.1 | C40.1 74.06,34.71 | 64.94,36.85 64.83,36.96 48.93,36.96 47.66,38.23 J1.2 J1.4
  Top 1.27: C44.1 276.08,47.2 | 276.08,47.2 C46.1 291.19,47.17 | 276.07,51.65 276.08,47.2 | 291.19,47.17 C45.+ | 291.19,47.17 301.87,47.17 | C22.1 137.15,98.68 134.11,98.68 129.37,98.68 IC3.1
  Top 2.032: C22.1 139.83,98.4 v139.87,98.43
  Bottom 0.254: 174.92,107.83 174.16,107.07 160.95,107.07 159.93,106.05 159.93,99.19
  Bottom 0.305: 159.93,83.57 159.93,99.19 | 174.92,107.83 v174.92,110.62
  Bottom 0.406: 297.85,43.82 295.82,43.82 295.82,53.47 302.43,53.47 302.43,43.82 300.9,43.82 | 297.85,45.09 297.6,45.09
  Bottom 0.61: 297.85,45.6 300.9,45.6 300.9,43.82 297.85,43.82 297.6,43.82 297.6,45.09 | 297.85,45.09 298.11,45.09 298.11,45.34
  Bottom 0.813: v74.08,34.72 81.49,34.72 98.97,52.46 98.97,79.63 129.45,79.63 129.45,74.05 129.93,73.32 PAD2.1
  Bottom 1.27: PAD2.1 131.41,71.51 PAD1.1
  Bottom 2.032: v139.87,98.43 139.81,98.38 139.81,83.49
  Bottom 2.184: 139.81,83.49 139.81,83.19 139.61,83.57
  Bottom 3.81: PAD9.1 291.54,70.69 PAD10.1 291.54,81.04 257.47,81.04 257.47,80.4 | PAD1.1 131.16,69.68 131.16,72.41 | 291.76,51.71 257.47,51.69 257.47,80.4 | 291.76,51.71 298.78,51.71 298.82,47.89 | 291.72,51.75 291.76,51.71 | 257.85,80.27 254.42,83.7 225.72,83.57 209.13,83.57 209.13,63.5 171.23,63.5 171.23,83.57 159.93,83.57 139.61,83.57 139.23,83.19 139.23,71.38 131.41,71.51 | 257.85,80.27 257.98,80.14 | 257.47,80.4 257.85,80.27
  other vias: 295.06,50.68 297.09,50.68 299.12,50.68 297.09,48.9 299.12,48.9 295.06,52.46 297.09,52.46 299.12,52.46
  pour Bottom: 295.82,53.22 295.82,43.82 302.43,43.82 302.43,53.22
  pour Top: 289.47,50.17 293.28,50.17 293.28,53.47 302.43,53.47 302.43,43.82 295.82,43.82 295.82,46.61 289.47,46.61
BOOT0  (via drill 0.3)
  Top 0.254: DFU.4 150.04,116.83 149.2,115.99 147.07,115.99 R5.1 v146.98,113.17 v146.98,113.16 | v146.98,109.35 146.93,109.32 146.47,108.87 146.47,93.1 134.79,81.41 v94.91,81.41 | STM32.94 84.17,82.31 v83.91,81.8
  Top 0.406: DFU.2 DFU.4
  Bottom 0.254: v94.91,81.41 94.78,81.54 84.37,81.54 84.17,81.54 v83.91,81.8 | v146.98,113.16 v146.98,109.35
GND  (via drill 0.3, 0.35, 0.6)
  Top 0.254: STM32.74 68.67,85.64 68.67,85.63 C10.2 66.67,84.5 | C4.2 66.52,85.59 66.46,85.53 66.46,84.71 66.67,84.5 | STM32.20 91.24,94.64 92.22,95.61 93.44,95.61 C14.2 94.92,95.65 95.16,95.89 | 66.67,84.5 66.67,83.74 v66.71,83.7 | C37.2 71.88,99.53 v72.05,99.7 | C16.2 94.25,102.1 94.4,102.24 | IC1.8 78.5,38.39 78.65,38.53 | C41.2 61.4,41.31 | C40.2 72.95,32.81 73.06,32.69 | C12.2 R4.2 86.68,75.67 86.78,75.57 | C26.1 125.39,22.48 | C21.1 125.39,24.86 125.39,24.77 | C20.1 125.39,27.23 | C19.1 125.39,29.6 | 125.39,29.6 | 119.68,122.99 114.59,122.99 114.54,122.94 LD1.C | 119.68,122.99 124.45,122.99 124.63,122.81 124.63,121.94 LD3.C | LD2.C 119.6,122.91 119.68,122.99 | R16.1 104.24,115.89 v106.34,115.96 | R15.1 90.75,116.05 v93.48,116.06 | STM32.27 86.67,100.35 86.65,100.4 86.65,100.91 87.03,101.22 88.05,101.22 88.3,100.97 v88.3,99.7 | STM32.10 90.24,89.64 v91.1,88.78 | C11.- 97.43,83.46 v97.45,83.44 | STM32.46 77.17,101.01 77.89,101.73 v78.65,108.08
  Top 0.305: 177.08,108.72 C34.2 177.49,108.59 172.12,108.59 171.68,109.03 U1.15
  Bottom 0.813: PAD3.1 131.2,60.42 131.23,60.39
  other vias: 91.56,120.73 41.31,114.94 54.52,115.19 89.07,74.55 87.8,75.06 91.1,93.86 95.67,95.89 95.42,102.24 93.13,104.78 89.32,108.84 86.78,108.84 81.45,108.84 74.08,105.29 72.05,103.26 72.05,82.43 110.78,104.4 110.78,101.22 110.78,98.05 110.78,94.87 110.78,91.7 120.31,91.7 120.31,88.52 120.31,85.35 123.48,85.35 126.66,85.35 129.83,85.35 133.01,85.35 133.01,88.52 133.01,91.7 133.01,94.87 136.18,91.7 139.36,107.57 136.18,104.4 142.53,104.4 117.13,107.57 123.48,107.57 129.83,107.57 64.68,76.08 65.82,68.59 276.52,41.79 276.52,40.26 276.52,38.74 283.38,41.79 283.38,40.26 283.38,38.74 285.41,41.79 285.41,40.26 285.41,38.74 287.44,41.79 287.44,40.26 287.44,38.74 287.44,43.31 285.41,43.31 283.38,43.31 289.47,43.31 289.47,41.79 289.47,40.26 289.47,38.74 83.6,44.96 108.75,29.98 66.84,37.34 104.36,120.65 133.99,120.6 146.02,120.6 101.38,30.99 101.38,32.26 101.38,33.53 105.04,32.09 112.56,25.66 115.1,25.66 107.73,25.66 105.19,26.42 101.64,26.42 101.64,23.63 117.89,23.63 115.35,15.75 117.89,15.75 112.56,15.75 110.27,15.75 107.73,15.75 105.19,15.75 84.87,44.96 86.14,44.96 86.14,46.23 86.14,47.5 84.87,46.23 65.95,56.01 62.14,56.01 59.35,56.01 61.38,63.63 59.6,67.7 93.89,109.1 91.35,110.11 78.65,111.38 78.65,113.67
  pour Bottom (isolate 0.406): 0.62,126.82 379.3,126.82 379.46,0.43 0.46,0.43
  pour Top (isolate 0.406): 0.46,126.91 0.46,0.52 379.47,0.52 379.32,126.68 0.53,126.84 0.53,126.91
N$1
  Top 0.254: C5.1 104.37,85.78 Q1.2 100.24,88.78 99.73,89.29 R6.1
N$2
  Top 0.254: C6.1 104.33,95.43 Q1.1 100.24,91.83 99.99,91.57 R7.1
N$3
  Top 0.813: POWER.C 246.12,61.08 R1.2
N$4
  Top 0.254: J2.13 R27.1
N$5
  Top 0.254: J2.11 R9.1
N$6
  Top 0.254: J2.9 R10.1
N$7
  Top 0.254: J2.7 R11.1
N$8
  Top 0.254: J2.5 R12.1
N$9
  Top 0.254: J2.3 R13.1
N$10
  Top 0.152: 71.69,48.61 C35.1 | 69.81,44.61 IC1.15 | 69.81,48.61 69.56,48.61 R20.2 69.81,48.61
  Top 0.254: IC1.15 69.76,48.55 69.81,48.61 69.86,48.65 C35.1
N$11
  Top 0.254: J2.1 R14.1
N$12
  Top 0.254: 116.24,99.95 116.24,95.13 116.75,94.62 119.04,94.62 119.8,95.38 123.86,95.38 125.39,96.91 125.9,96.91 126.4,97.41 126.4,100.21 126.15,100.46 116.75,100.46 116.24,99.95
  pour Top: 116.24,95.13 116.75,94.62 119.04,94.62 119.8,95.38 123.86,95.38 125.39,96.91 125.9,96.91 126.4,97.41 126.4,100.21 126.15,100.46 116.75,100.46 116.24,99.95
N$13
  Top 0.254: C30.2 173.68,118.27 173.74,117.32 172.98,116.45 U1.1
N$14
  Top 0.254: C30.1 171.78,118.19 170.4,116.56 170.4,116.44 U1.3
N$15
  Top 0.254: C31.2 169.33,118.46 169.15,117.01 169.15,116.43 U1.4
N$16
  Top 0.254: C31.1 167.43,118.74 167.89,117.01 167.89,116.45 U1.5
N$17
  Top 0.254: C33.2 165.03,118.15 166.64,116.55 166.64,116.46 U1.6
N$18
  Top 0.152: 175.6,113.59 C32.1
  Top 0.254: 171.68,115.41 U1.2 171.68,113.86 172.38,113.16 175.75,113.16 C32.1
N$19
  Top 0.254: LD1.A 112.44,119.93 R29.2
N$20  (via drill 0.6 pad 0.25)
  Top 0.254: 274.99,30.87 274.99,29.34 259.5,29.34 259.5,38.99 274.99,38.99 274.99,36.96
  Top 0.406: 302.43,33.41 302.43,30.87 274.99,30.87 274.99,36.96 295.57,36.96 | 302.43,37.72 302.43,40.77 300.9,40.77 | 300.9,40.77 297.6,40.77 | 297.6,40.77 295.57,40.77 295.57,37.72 | 295.57,37.72 295.57,36.96 | 295.57,36.96 295.57,33.41 302.43,33.41 | 302.43,33.41 302.43,37.72 | 302.43,37.72 295.57,37.72 | 299.38,39.25 298.11,39.25 298.11,39.5 297.85,39.5 297.85,39.76 297.6,39.76 297.6,40.26 297.85,40.26 297.85,40.52 297.6,40.52 297.6,40.77 | 299.63,39.25 300.39,39.25 300.39,39.5 300.9,39.5 300.9,40.77
  Top 0.813: v270.57,36.44 269.79,37.21 269.7,37.21 269.7,37.16 v268.98,36.44 | v270.57,34.85 270.57,34.38 270.25,34.06 270.57,33.74 v270.57,33.27 | IC2.6 269.82,34.01 v270.57,33.27 | 269.7,35.59 269.7,35.57 v268.98,34.85 | 269.59,33.9 269.59,33.88 v268.98,33.27 | v268.98,31.68 v268.98,33.27 | v268.98,34.85 v267.4,36.44 | v267.4,36.44 v265.81,38.03 v265.81,36.44 v265.81,34.85 v265.81,33.27 v265.81,31.68 v267.4,31.68 v267.4,33.27 v267.4,34.85 v267.4,36.44 | v267.4,38.03 v267.4,36.44 | v270.57,38.03 v268.98,38.03 v268.98,36.44 | v268.98,36.44 v268.98,34.85 | v268.98,34.85 v268.98,33.27 | v268.98,33.27 268.98,31.52 270.41,31.52 v270.57,31.68 v270.57,33.27 | v270.57,33.27 v270.57,36.44 | v270.57,36.44 v270.57,38.03 | v270.57,38.03 v272.16,38.03 v272.16,36.44 v272.16,34.85 v273.74,34.85 | v272.16,33.27 v272.16,31.68 v273.74,31.68 v273.74,33.27 v273.74,34.85 | v273.74,34.85 v273.74,36.44 v273.74,38.03
  Top 1.27: 269.7,38.71 269.7,37.21 | IC2.3 269.7,38.82 | 269.7,38.82 269.7,38.71 | 269.7,35.59 IC2.6 | v270.57,38.03 270.49,38.03 269.7,38.82 | 268.82,38.03 v268.98,38.03 269.67,38.71 269.7,38.71
  Top 1.93: 269.7,35.59 269.7,38.71
  Top 6.452: 269.7,35.59 270.17,33.91 | 269.59,33.9 IC2.6
  Bottom 0.254: 297.6,40.77 302.43,40.77 302.43,30.87 274.99,30.87 274.99,29.34 259.5,29.34 259.5,38.99 274.99,38.99 274.99,36.96 295.57,36.96 295.57,40.77 297.6,40.77 | 297.6,40.52 297.6,40.77
  Bottom 0.813: 297.6,40.52 297.6,39.5 300.9,39.5 300.9,40.52
  other vias: 272.17,30.2 270.56,30.18 268.99,30.21 267.39,30.15 265.82,30.15 276.1,36.44 276.1,34.87 276.1,33.25 276.1,31.66 273.74,30.15 263.52,34.85 263.52,33.27 263.52,31.68 263.54,30.15 263.52,36.44 263.52,38.03 262,38.03 262,36.44 262,34.85 262,33.27 262,31.68 262.01,30.15 260.49,30.15 260.47,31.68 260.47,33.27 260.47,34.85 260.47,36.44 260.47,38.03
  pour Top: 259.5,29.34 259.5,38.99 274.99,38.99 274.99,29.34
  pour Top: 274.99,36.96 295.57,36.96 295.57,40.77 302.43,40.77 302.43,30.87 274.99,30.87
  pour Bottom: 259.5,38.99 274.99,38.99 274.99,36.96 295.57,36.96 295.57,40.77 302.43,40.77 302.43,30.87 274.99,30.87 274.99,29.34 259.5,29.34
N$21
  Top 0.813: 271.44,42.16 271.44,51.69 | 271.44,51.69 273.27,51.69 R31.1 | 271.44,51.69 269.59,51.69 R32.2 | 271.44,42.16 271.45,44.34 271.95,44.34 | IC2.2 271.44,42.16
  Top 1.27: C46.2 271.95,44.34
N$22
  Top 0.254: IC1.14 71.06,44.57 71.06,45.92 73.65,48.5 C35.2
N$23
  Top 0.254: LD3.A 122.57,119.93 R28.2
N$24
  Top 1.27: C36.2 IC2.4
N$25
  Top 0.305: ST1.4 68.28,116.76 R33.1
N$26
  Top 0.254: LD2.A 117.5,119.95 R30.2
N$39
  Top 0.305: ST1.3 69.08,115.84 R19.1
N$40
  Top 0.305: ST1.2 69.88,116.94 R18.1
PA0  (via drill 0.3)
  Top 0.254: STM32.23 90.33,96.14 90.84,96.65 90.84,99.7 91.61,100.46 v91.61,108.34
  Bottom 0.254: v91.61,108.34 89.83,110.11 87.29,110.11 83.73,113.67 83.73,115.19 82.21,116.72 76.62,116.72 74.33,114.43 74.33,110.11 69,104.78 69,88.52 70.27,87.25 70.27,86.24 65.7,81.67 57.32,81.67 54.01,84.97 RUN.1
PA3  (via drill 0.3)
  Top 0.254: STM32.26 87.24,100.16 v87.54,100.46
  Bottom 0.254: v87.54,100.46 87.54,109.1 83.22,113.42 83.22,114.94 81.95,116.21 76.87,116.21 74.84,114.18 74.84,109.86 69.51,104.53 69.51,88.78 70.78,87.51 70.78,85.98 59.86,75.06 59.86,71.76 59.35,71.25 48.68,71.25 J1.26
PA4  (via drill 0.3)
  Top 0.254: STM32.29 85.67,102.08 83.99,103.76 83.99,109.1 82.46,110.62 v82.46,111.64
  Bottom 0.254: v82.46,111.64 82.46,114.69 81.45,115.7 77.13,115.7 75.35,113.92 75.35,109.61 70.02,104.27 70.02,89.03 71.29,87.76 71.29,85.73 60.36,74.81 60.36,69.22 59.86,68.71 48.68,68.71 J1.24
PA5  (via drill 0.3)
  Top 0.254: STM32.30 85.17,101.82 83.48,103.51 83.48,108.84 81.7,110.62 v81.7,111.13
  Bottom 0.254: v81.7,111.13 81.7,114.43 80.94,115.19 77.38,115.19 75.86,113.67 75.86,109.1 70.52,103.76 70.52,89.29 71.79,88.02 71.79,85.48 60.87,74.55 60.87,67.19 60.36,66.68 48.68,66.68 48.43,66.43 46.39,66.43 J1.23
PA6  (via drill 0.3)
  Top 0.254: STM32.31 84.67,101.56 82.97,103.26 82.97,108.59 v80.94,110.62
  Bottom 0.254: v80.94,110.62 80.94,114.18 80.43,114.69 77.64,114.69 76.37,113.42 76.37,108.84 71.03,103.51 71.03,89.54 72.3,88.27 72.3,85.22 62.27,75.19 62.27,66.55 61.38,65.66 50.2,65.66 48.43,63.89 46.39,63.89 J1.21
PA10  (via drill 0.3)
  Top 0.254: v66.97,89.03 68.75,89.03 69.64,88.14 STM32.69 | v66.97,110.37 66.97,110.88 65.95,111.89 65.95,113.44 R33.2
  Bottom 0.254: v66.97,110.37 v66.97,89.03
PA11  (via drill 0.35)
  Top 0.254: STM32.70 68.87,87.64 v68.49,88.02 | R18.2 71.44,113.57 v68.49,110.37
  Bottom 0.254: v68.49,88.02 v68.49,110.37
PA12  (via drill 0.3)
  Top 0.254: STM32.71 69.82,87.14 v69.51,86.82 | R19.2 69.12,112.26 v67.72,110.87
  Bottom 0.254: v69.51,86.82 69.02,87.31 68.2,87.31 67.73,87.78 67.73,103.76 v67.72,110.87
PA13  (via drill 0.3)
  Top 0.254: v74.33,81.67 v74.33,84.21 | STM32.72 74.99,86.64 v75.1,86.75
  Bottom 0.254: SWD.4 66.91,78.81 67.73,79.63 72.3,79.63 v74.33,81.67 | v74.33,84.21 74.33,85.98 v75.1,86.75
PA14  (via drill 0.3)
  Top 0.254: STM32.76 v75.09,80.95 | v72.05,75.88 SWD.2
  Bottom 0.254: v75.09,80.95 72.05,77.86 v72.05,75.88
PB0  (via drill 0.3)
  Top 0.254: STM32.35 82.67,100.67 v82.97,100.97 | v119.55,111.64 84.49,111.64 v83.48,111.64 | v119.55,113.92 119.39,114.08 R30.1
  Bottom 0.254: v119.55,111.64 v119.55,113.92 | v82.97,100.97 82.97,111.13 v83.48,111.64
PB1  (via drill 0.3)
  Top 0.254: C26.2 v119.04,22.48 R14.2 | 113.2,31.37 v113.45,31.37 87.29,57.54 v87.29,64.39 | STM32.36 82.17,92.88 82.72,92.33 v82.72,85.22
  Bottom 0.254: v119.04,22.48 119.04,25.79 v113.45,31.37 | v82.72,85.22 82.72,78.11 86.53,74.3 86.53,65.16 v87.29,64.39
PB2
  Top 0.254: STM32.37 81.67,103.54 R17.2
PB4  (via drill 0.3)
  Top 0.254: STM32.90 82.17,81.23 v82.04,81.17 | C17.2 v106.34,25.02 R9.2 | v84.24,63.12 84.24,55.76 106.34,33.66 v106.34,29.6
  Bottom 0.254: v84.24,63.12 84.24,72.27 82.11,74.4 v82.04,81.17 | v106.34,25.02 v106.34,29.6
PB5  (via drill 0.3)
  Top 0.254: STM32.91 82.67,80.85 80.68,78.87 80.68,77.86 76.05,73.35 66.46,73.28 65.7,73.28 64.94,72.52 v62.9,72.52
  Bottom 0.254: v62.9,72.52 62.9,62.87 62.4,62.36 49.44,62.36 48.43,61.35 46.39,61.35 J1.19
PB6  (via drill 0.6)
  Top 0.254: STM32.92 83.17,84.4 83.48,84.71 83.48,93.81 83.73,94.06 83.73,96.35 84.29,96.91 87.03,96.91 90.84,100.72 90.84,108.59 92.37,110.11 v155.61,110.11 162.47,110.11 163.49,108.59 166.03,108.59 166.6,109.17 U1.11
  Bottom 0.406: 3V3_TTL_TX.1 156.63,111.13 v155.61,110.11
PB7  (via drill 0.3)
  Top 0.254: STM32.93 83.67,84.14 84.24,84.71 84.24,95.89 v84.49,96.14 | v124.37,111.64 123.61,110.88 v84.49,110.88 | R28.1 124.5,114.05 v124.37,113.92
  Bottom 0.254: v84.49,96.14 v84.49,110.88 | v124.37,111.64 v124.37,113.92
PB8  (via drill 0.3)
  Top 0.254: STM32.95 84.67,80.82 82.97,79.13 v82.97,75.57 | C19.2 111.67,29.6 | 111.67,29.6 111.42,29.6 R11.2 | v85,62.11 85,56.27 111.67,29.6
  Bottom 0.254: v82.97,75.57 85,73.54 v85,62.11
PB9  (via drill 0.3)
  Top 0.254: STM32.96 85.17,80.56 83.73,79.13 v83.73,76.08 | C20.2 v113.96,27.23 R12.2 | v85.76,63.12 85.76,56.77 v112.18,30.36
  Bottom 0.254: v113.96,27.23 113.96,28.58 v112.18,30.36 | v83.73,76.08 85.76,74.05 v85.76,63.12
PB11
  Top 0.254: STM32.48 76.17,101.53 76.87,102.24 76.87,108.34 80.94,112.4 167.04,112.4 167.87,111.57 U1.12
PB12  (via drill 0.3)
  Top 0.254: C21.2 v116.5,24.86 R13.2 | v52.74,64.92 53,65.41 53,82.17 53.04,82.23 v57.06,86.25 | v77.17,64.92 78.71,64.9 85.26,64.9 86.53,63.63 86.53,57.28 v113.45,30.36 | v57.06,91.06 57.06,92.33 61.43,96.7 61.94,97.21 STM32.51 | v59.09,64.9 v65.95,64.9
  Bottom 0.254: v116.5,24.86 116.5,27.31 v113.45,30.36 | v57.06,91.06 v57.06,86.25 | v52.74,64.92 59.08,64.92 v59.09,64.9 | v65.95,64.9 77.16,64.9 v77.17,64.92
PB14
  Top 0.254: STM32.53 74.33,96.14 74.59,96.4 74.59,97.41 74.08,97.92 69.51,97.92 69,98.43 69,102.51 69,102.71 69.2,102.95 79.41,113.16 111.93,113.16 114,115.24 114.21,115.45 114.36,115.59 R29.1
PC0  (via drill 0.3)
  Top 0.254: STM32.15 87.85,92.14 v87.29,91.57 | v83.48,80.65 81.45,78.62 81.45,77.86 76.37,72.78 66.21,72.78 65.19,71.76 61.89,71.76 v61.63,71.51
  Bottom 0.254: v87.29,91.57 87.29,85.22 86.78,84.71 84.24,84.71 83.22,83.7 83.22,80.9 v83.48,80.65 | v61.63,71.51 61.63,66.93 60.87,66.17 48.93,66.17 48.43,65.66 48.17,65.66 J1.22
PC2  (via drill 0.3)
  Top 0.254: R27.2 v103.8,22.48 C29.2 | STM32.17 86.57,93.14 85,91.57 85,89.29 86.27,88.02 86.27,85.98 v86.53,85.73 | v83.48,62.11 83.48,55.25 103.8,34.93 v103.8,28.83
  Bottom 0.254: v103.8,22.48 v103.8,28.83 | v86.53,85.73 83.18,85.73 83,85.91 82.39,85.91 81.95,85.48 81.95,81.92 81.4,81.36 81.4,74.09 83.48,72.01 v83.48,62.11
PC7  (via drill 0.3)
  Top 0.254: STM32.64 68.66,90.64 67.98,91.32 65.91,91.32 65.73,91.5 65.16,91.5 64.98,91.32 58.94,91.32 v57.82,90.2 | JP1.16 56.3,53.49 53.76,56.03 53.76,81.67 v57.82,85.73
  Bottom 0.254: v57.82,85.73 v57.82,90.2
PC8  (via drill 0.3)
  Top 0.254: STM32.65 68.15,90.14 67.48,90.81 v65.44,90.81 | R25.2 54.78,106.08 v54.78,107.57 54.78,109.86 54.27,110.37 54.27,111.39 SD.DAT0
  Bottom 0.254: v65.44,90.81 65.44,99.95 57.82,107.57 v54.78,107.57
PC9  (via drill 0.3)
  Top 0.254: STM32.66 67.89,89.64 67.48,90.05 v66.21,90.05 | R26.2 57.82,106.02 v57.82,108.59 57.82,109.86 57.57,110.11 55.79,110.11 55.42,110.48 SD.DAT1
  Bottom 0.254: v66.21,90.05 66.21,100.21 v57.82,108.59
PC10  (via drill 0.3)
  Top 0.254: STM32.78 76.17,80.7 75.6,80.14 68.49,80.14 65.19,83.44 65.19,88.52 64.43,89.29 57.82,89.29 54.52,92.59 43.35,92.59 v40.55,95.38 | v43.35,107.57 43.35,106.01 R21.2
  Top 0.305: 47.69,111.41 47.69,110.39 47.41,110.11 44.36,110.11 43.35,109.1 v43.35,107.57
  Top 0.406: 47.69,111.41 SD.DAT2
  Bottom 0.254: v40.55,95.38 40.55,104.78 v43.35,107.57
PC11  (via drill 0.3)
  Top 0.254: STM32.79 76.67,80.19 76.11,79.63 68.28,79.63 64.68,83.23 64.68,88.27 64.17,88.78 57.57,88.78 54.27,92.08 42.84,92.08 v40.55,94.37 | v46.14,108.34 46.14,106.1 R22.2
  Top 0.305: 48.81,111.43 48.81,110.5 47.66,109.35 46.65,109.35 46.14,108.84 v46.14,108.34
  Top 0.406: 48.81,111.43 SD.DAT3/CS
  Bottom 0.254: v46.14,108.34 43.09,108.34 39.79,105.03 39.79,95.13 v40.55,94.37
PC12  (via drill 0.3)
  Top 0.254: STM32.80 77.17,79.67 76.62,79.13 68.07,79.13 64.17,83.02 64.17,87.76 63.67,88.27 57.32,88.27 54.01,91.57 42.33,91.57 v39.03,94.87 | v51.98,108.84 51.98,106.02 R24.2
  Top 0.305: SD.CLK 52.12,108.99 v51.98,108.84
  Bottom 0.254: v39.03,94.87 39.03,105.29 42.84,109.1 51.73,109.1 v51.98,108.84
PD2  (via drill 0.3)
  Top 0.254: STM32.83 78.67,80.16 77.13,78.62 67.86,78.62 63.67,82.81 63.67,87.25 63.16,87.76 57.06,87.76 53.76,91.06 41.57,91.06 v39.03,93.6 | v49.19,109.86 R23.2 | R23.2
  Top 0.305: v49.19,109.86 49.44,109.86 49.95,110.37 49.95,111.42 SD.CMD
  Bottom 0.254: v49.19,109.86 42.58,109.86 38.27,105.54 38.27,94.37 v39.03,93.6
PD3  (via drill 0.3)
  Top 0.254: STM32.84 79.17,84.45 77.13,86.49 v77.13,96.4 | v77.13,113.16 77.13,113.42 79.76,116.05 87.35,116.05 | 87.35,116.05 R15.2 | 87.54,115.86 87.35,116.05
  Top 0.406: R15.2 87.45,118.32 BTN1.3 | BTN1.3 BTN1.1 | BTN1.3
  Bottom 0.254: v77.13,96.4 v77.13,113.16
PD4  (via drill 0.3)
  Top 0.254: 100.36,116.48 R16.2 | 100.43,115.96 R16.2 | STM32.85 79.67,84.97 80.18,85.48 v80.18,96.4 | v80.18,113.92 99.48,113.92 100.36,114.81 R16.2
  Top 0.406: BTN2.1 BTN2.3 100.41,115.95 R16.2
  Bottom 0.254: v80.18,96.4 v80.18,113.92
PD5  (via drill 0.3)
  Top 0.254: STM32.86 80.17,81.15 79.16,80.14 79.16,77.86 75.6,74.36 65.7,74.31 | 65.7,74.31 v64.17,74.3 65.69,74.3 65.7,74.31
  Bottom 0.254: v64.17,74.3 63.67,73.79 63.67,51.69 62.9,50.93 48.68,50.93 J1.10
PD6  (via drill 0.3)
  Top 0.254: STM32.87 80.67,80.89 79.92,80.14 79.92,77.86 75.79,73.86 65.7,73.79 64.94,73.79 v64.68,73.54
  Bottom 0.254: v64.68,73.54 64.43,73.28 64.43,49.66 63.16,48.39 48.68,48.39 J1.8
PD10  (via drill 0.3)
  Top 0.254: JP1.10 58.33,61.11 57.57,61.87 57.57,80.4 v60.87,83.7 | STM32.57 71.26,94.14 69.51,95.89 v61.63,95.89
  Bottom 0.254: v60.87,83.7 61.63,84.46 v61.63,95.89
PD11  (via drill 0.3)
  Top 0.254: JP1.9 71.15,60.85 70.14,59.84 57.82,59.84 56.81,60.85 56.81,80.65 v60.87,84.71 | STM32.58 70.74,93.64 69.25,95.13 v60.87,95.13
  Bottom 0.254: v60.87,84.71 v60.87,95.13
PD12  (via drill 0.3)
  Top 0.254: JP1.12 57.57,58.57 56.05,60.09 56.05,80.9 v59.35,84.21 | STM32.59 70.23,93.14 69,94.37 v60.11,94.37
  Bottom 0.254: v59.35,84.21 60.11,84.97 v60.11,94.37
PD13  (via drill 0.3)
  Top 0.254: JP1.11 70.9,58.31 69.63,57.3 57.06,57.3 55.28,59.08 55.28,81.16 v59.35,85.22 | STM32.60 69.71,92.64 68.75,93.6 v59.35,93.6
  Bottom 0.254: v59.35,85.22 v59.35,93.6
PD14  (via drill 0.3)
  Top 0.254: JP1.7 71.15,63.39 70.14,62.38 58.84,62.38 58.33,62.89 58.33,80.14 v62.4,84.21 | STM32.61 69.2,92.14 68.49,92.84 v62.4,92.84
  Bottom 0.254: v62.4,84.21 v62.4,92.84
PD15  (via drill 0.3)
  Top 0.254: JP1.13 70.13,54.76 56.81,54.76 54.52,57.04 54.52,81.41 v57.82,84.71 | STM32.62 68.68,91.64 68.24,92.08 v58.59,92.08
  Bottom 0.254: v57.82,84.71 58.59,85.48 v58.59,92.08
PDRON
  Top 0.254: STM32.99 86.67,78.55 R4.1
PE0
  Top 0.254: JP1.2 69.12,71.77 69.44,72.35 81.27,72.35 84.49,75.57 84.49,79.13 85.67,80.3 STM32.97
PE1
  Top 0.254: JP1.1 81.21,71.27 85.26,75.32 85.26,79.13 86.17,80.04 STM32.98
PE2
  Top 0.254: JP1.4 69.37,68.72 70.4,70 86.54,70 90.59,73.79 90.59,83.71 STM32.1
PE3
  Top 0.254: JP1.6 69.38,66.19 70.4,67.46 74.56,67.46 76.06,68.95 86.67,68.95 91.35,73.54 91.35,84.97 90.68,85.64 STM32.2
PE4
  Top 0.254: JP1.5 74.43,66.19 76.46,68.21 86.78,68.2 92.11,73.28 92.11,85.22 91.2,86.14 STM32.3
PE5
  Top 0.254: JP1.8 69.13,63.65 70.4,64.92 74.35,64.92 76.87,67.44 87.03,67.44 92.88,73.03 92.88,85.48 91.71,86.64 STM32.4
PE6
  Top 0.254: JP1.14 69.63,56.03 70.65,57.04 70.9,57.3 73.44,57.3 74.08,57.93 74.08,63.38 77.38,66.68 87.29,66.68 93.64,72.78 93.64,85.73 92.23,87.14 STM32.5
PH0
  Top 0.254: STM32.12 91.78,90.64 93.13,89.29 R6.2
PH1
  Top 0.254: STM32.13 91.93,91.14 92.37,91.57 R7.2
PIN_DMD_DCLK  (via drill 0.3)
  Top 0.254: IC1.2 69.68,38.47 69.68,39.77 70.25,40.35 SJ1.2 97.11,40.35 99.23,38.23 99.23,28.33 99.99,27.56 | C18.2 99.99,27.56 | 99.99,27.56 v108.88,27.56 R10.2
PIN_DMD_DCLK_  (via drill 0.3)
  Top 0.254: SJ1.1 80.94,41.95 73.7,41.95 72.3,43.36 IC1.13 72.3,45.89 73.32,46.92 79.67,46.92 82.46,49.71 v82.46,63.12 | STM32.47 76.67,97.88 76.87,97.67 77.13,97.67 77.38,97.41 80.94,97.41 81.7,96.65 81.67,91.28 STM32.89 81.67,82.14 81.19,81.67 81.19,80.4 v80.68,79.89
  Bottom 0.254: v82.46,63.12 82.46,71.81 80.68,73.58 v80.68,79.89
RESET  (via drill 0.3)
  Top 0.254: 130,115.92 R3.1 129.96,115.88 v129.96,113.92 | STM32.14 91.16,91.64 93.13,93.6 96.43,93.6 97.19,94.37 97.19,96.91 98.97,98.68 105.07,98.68 106.85,96.91 108.57,96.91 C2.1 108.59,107.54 110.4,109.35 v129.96,109.35
  Top 0.406: R3.1 128.74,115.9 127.93,116.72 127.93,120.85 RESET.1 RESET.3
  Bottom 0.254: v129.96,109.35 v129.96,113.92
RX1  (via drill 0.3)
  Top 0.254: v167.23,113.38 169.15,111.72 169.15,111.63 U1.13
  Bottom 0.254: RS232.3 165.84,120.86 166.18,120.53 166.18,117.67 167.23,116.61 v167.23,113.38
TX1  (via drill 0.3)
  Top 0.254: U1.14 v170.41,112.49
  Bottom 0.254: RS232.1 171.03,123.93 | v170.41,112.49 169.77,113.13 169.77,116.73 170.4,117.62 170.4,123.24 170.92,123.76
  Bottom 0.305: 170.92,123.76 RS232.1
VBAT  (via drill 0.3)
  Top 0.254: R2.1 107.96,87.44 C1.+ 107.79,87.32 105.83,89.29 v105.58,89.29 | STM32.6 91.48,87.64 v91.86,88.02
  Bottom 0.254: v105.58,89.29 104.05,89.29 102.53,87.76 92.11,87.76 v91.86,88.02
VCAP1
  Top 0.254: STM32.49 75.67,103.55 C3.1
VCAP2
  Top 0.254: 68.93,86.14 STM32.73
  Top 0.305: 68.93,86.14 67.52,87.55 66.57,87.55 C4.1
VDDA
  Top 0.254: STM32.22 90.79,95.64
  Top 0.305: 90.79,95.64 91.56,96.41 91.56,98.82 C16.1 | R8.2 98.69,105.67 L1.2
  Top 0.406: C16.1 96.04,100.2 97.92,102.08 98.69,102.08 R8.2 | 98.69,105.67 98.6,105.67 C15.1
VIN
  Top 0.813: 265.92,43.04 IC2.5
  Top 1.27: 265.92,43.04 C36.1 | C38.1 252.43,41.53
  Top 1.778: 252.43,41.53 251.54,41.53 D3.C
  Top 1.93: 264.95,41.71 264.95,42.71 265.92,43.04
  Top 3.81: C39.+ 260.95,46.59 | 260.95,46.59 264.95,46.59 264.95,42.71 | 260.95,46.59 252.43,46.59 | 252.43,46.59 252.43,41.53 252.43,21.21 | WPC.3 286.12,11.61 286.17,17.4 256.24,17.4 252.43,21.21 | 252.43,21.21 252.41,21.21 X1.1 | 252.43,46.59 252.39,46.59 252.39,52.46 241.47,52.46 241.47,83.7 225.97,83.7 225.97,114.69 227.85,114.69 SAM.4 SAM.3
VREF
  Top 0.254: STM32.21 91.06,95.14 C14.1 95.78,97.55 R8.1
  Top 0.406: R8.1 100.24,100.46 100.75,99.95 102.42,99.95 C13.1

### Text on the board
tPlace: GND | GND | +5V | +5V | 5V DC POWER | 1 | HUB75 | GND | +12V | Key | 12V DC POWER
tNames: TX | GND | GND | TX | RX | + | + | + | + | DIO | GND | CLK | +3V3 | + | 8-36V DC | + | - | COLORPRISM 128 X 32 | EVO128X32 BOARD REV 1.6 / (C) 2025 WWW.PIN2DMD.COM
bNames: + | + | + | + | - | - | - | -